# Altium schematic sheet Main MCU.SchDoc
size A; SheetNumber: 1; SheetTotal: 3
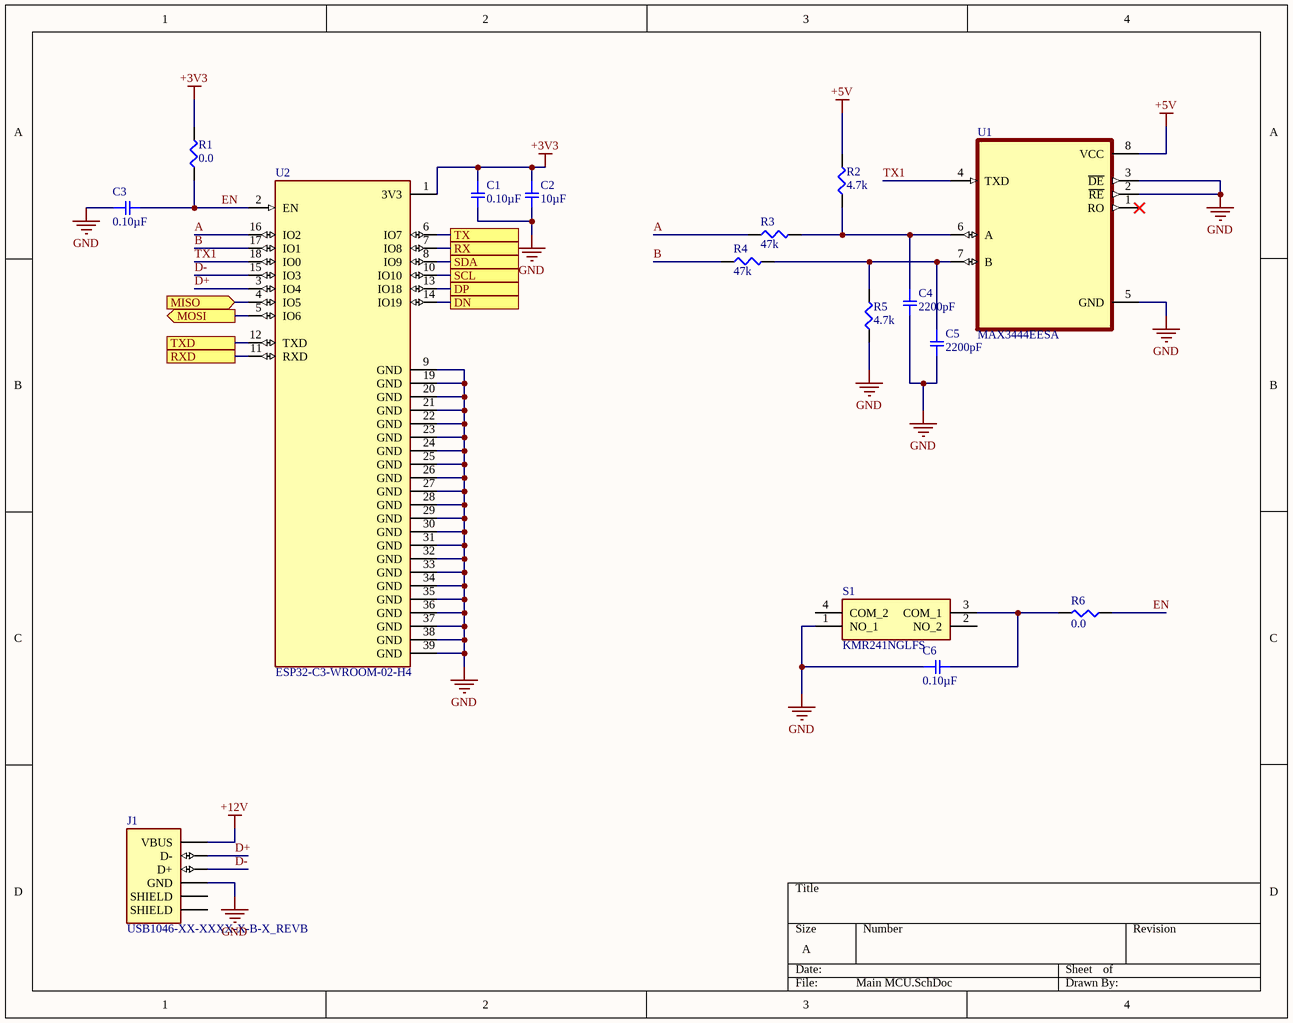
[diagram p0: Main MCU.SchDoc]

## Parts
C1  0.10µF  [SMD-0402C]
C2  10µF  [SMD-0402C]
C3  0.10µF  [SMD-0402C]
C4  2200pF  [SMD-0402C]
C5  2200pF  [SMD-0402C]
C6  0.10µF  [SMD-0402C]
J1  USB1046-XX-XXXX-X-B-X_REVB  [GCT_USB1046-XX-XXXX-X-B-X_REVB]
R1  0.0  [SMD-0402-RES]
R2  4.7k  [SMD-0402-RES]
R3  47k  [SMD-0402-RES]
R4  47k  [SMD-0402-RES]
R5  4.7k  [SMD-0402-RES]
R6  0.0  [SMD-0402-RES]
S1  KMR241NGLFS  [KMR241NGLFS]
U1  MAX3444EESA  [SOIC127P600X175-8N]
U2  ESP32-C3-WROOM-02-H4  [MODULE_ESP32-C3-WROOM-02-H4]

## Ports
DN, DP, MISO (in), MOSI (out), RX, RXD, SCL, SDA, TX, TXD

## Nets
+3V3: C1.1 C2.1 R1.2 U2.1(3V3)
+5V: R2.2 U1.8(VCC)
+12V: J1.1(VBUS)
GND: C1.2 C2.2 C3.1 C4.2 C5.2 C6.1 J1.4(GND) R5.1 S1.1(NO_1) U1.2(~{RE}) U1.3(~{DE}) U1.5(GND) U2.9(GND) U2.19(GND) U2.20(GND) U2.21(GND) U2.22(GND) U2.23(GND) U2.24(GND) U2.25(GND) U2.26(GND) U2.27(GND) U2.28(GND) U2.29(GND) U2.30(GND) U2.31(GND) U2.32(GND) U2.33(GND) U2.34(GND) U2.35(GND) U2.36(GND) U2.37(GND) U2.38(GND) U2.39(GND)
A: R3.1 U2.16(IO2)
B: R4.1 U2.17(IO1)
D+: J1.2(D-) U2.3(IO4)
D-: J1.3(D+) U2.15(IO3)
DN: U2.14(IO19) ; port DN
DP: U2.13(IO18) ; port DP
EN: C3.2 R1.1 R6.1 U2.2(EN)
MISO: U2.4(IO5) ; port MISO
MOSI: U2.5(IO6) ; port MOSI
RX: U2.7(IO8) ; port RX
RXD: U2.11(RXD) ; port RXD
SCL: U2.10(IO10) ; port SCL
SDA: U2.8(IO9) ; port SDA
TX: U2.6(IO7) ; port TX
TX1: U1.4(TXD) U2.18(IO0)
TXD: U2.12(TXD) ; port TXD
NetC4_1: C4.1 R2.1 R3.2 U1.6(A)
NetC5_1: C5.1 R4.2 R5.2 U1.7(B)
NetC6_2: C6.2 R6.2 S1.3(COM_1)

Not connected (* = marked no-connect by the designer): J1 P1(SHIELD) P2(SHIELD); S1 2(NO_2) 4(COM_2); U1 1(RO)*

## Library data of the parts
C1 C3 C6 = GCM155R71C104KA55D: CAP CER 0.1UF 16V X7R 0402; Manufacturer: Murata Electronics North America; Factory Stock: 0; Unit Price (USD): 0.1; Minimum Quantity: 1; Tolerance: ±10%; Datasheets: http://www.murata.com/~/media/webrenewal/support/library/catalog/products/capacitor/mlcc/c03e.ashx; Image: //media.digikey.com/Renders/Murata%20Renders/ZRB-SERIES-0402.jpg; Digi-Key Part Number: 490-4759-1-ND; Part Number: GCM155R71C104KA55D; Quantity Available: 734194; @ qty: 0; Packaging: Cut Tape (CT); Series: GCM; Part Status: Active; Value: 0.10µF; Voltage: 16V; Temperature Coefficient: X7R; Operating Temperature: -55°C ~ 125°C; Features: -; Ratings: AEC-Q200; Applications: Automotive; Mounting Type: Surface Mount, MLCC; Package / Case: 0402 (1005 Metric); Size / Dimension: 0.039" L x 0.020" W (1.00mm x 0.50mm); Height - Seated (Max): -; Thickness (Max): 0.022" (0.55mm); Lead Spacing: -; Lead Style: -
C2 = GRJ155R60J106ME11D: CAP CER 10UF 6.3V X5R 0402; Manufacturer: Murata Electronics North America; Factory Stock: 0; Unit Price (USD): 0.23; Minimum Quantity: 1; Tolerance: ±20%; Datasheets: http://psearch.en.murata.com/capacitor/product/GRJ155R60J106ME11%23.pdf; Image: //media.digikey.com/Renders/Murata%20Renders/ZRB-SERIES-0402.jpg; Digi-Key Part Number: 490-13211-1-ND; Part Number: GRJ155R60J106ME11D; Quantity Available: 64064; @ qty: 0; Packaging: Cut Tape (CT); Series: GRJ; Part Status: Active; Value: 10µF; Voltage: 6.3V; Temperature Coefficient: X5R; Operating Temperature: -55°C ~ 85°C; Features: Derating Recommended, Soft Termination; Ratings: -; Applications: Boardflex Sensitive; Mounting Type: Surface Mount, MLCC; Package / Case: 0402 (1005 Metric); Size / Dimension: 0.039" L x 0.020" W (1.00mm x 0.50mm); Height - Seated (Max): -; Thickness (Max): 0.028" (0.70mm); Lead Spacing: -; Lead Style: -
C4 C5 = GCM155R71H222KA37D: CAP CER 2200PF 50V X7R 0402; Manufacturer: Murata Electronics North America; Factory Stock: 0; Unit Price (USD): 0.1; Minimum Quantity: 1; Tolerance: ±10%; Datasheets: http://www.murata.com/~/media/webrenewal/support/library/catalog/products/capacitor/mlcc/c03e.ashx; Image: //media.digikey.com/Renders/Murata%20Renders/ZRB-SERIES-0402.jpg; Digi-Key Part Number: 490-4914-1-ND; Part Number: GCM155R71H222KA37D; Quantity Available: 56459; @ qty: 0; Packaging: Cut Tape (CT); Series: GCM; Part Status: Active; Value: 2200pF; Voltage: 50V; Temperature Coefficient: X7R; Operating Temperature: -55°C ~ 125°C; Features: -; Ratings: AEC-Q200; Applications: Automotive; Mounting Type: Surface Mount, MLCC; Package / Case: 0402 (1005 Metric); Size / Dimension: 0.039" L x 0.020" W (1.00mm x 0.50mm); Height - Seated (Max): -; Thickness (Max): 0.022" (0.55mm); Lead Spacing: -; Lead Style: -
J1 = USB1046-XX-XXXX-X-B-X_REVB: USB Receptacle, Type A, 4 Pin, Surface Mount, Horizontal, Top Mount, with Shell Stakes; MF: {'manufacturer': u'Global Connector Technology'}; Package: None; Price: None; Value: *; MP: USB1046-XX-XXXX-X-B-X_REVB; Availability: Unavailable
R1 R6 = ERJ-2GE0R00X: RES SMD 0.0OHM JUMPER 1/10W 0402; Manufacturer: Panasonic Electronic Components; Factory Stock: 0; Unit Price (USD): 0.00384; @ qty: 1500; Minimum Quantity: 1; Power (Watts): 0.1W, 1/10W; Part Number: ERJ-2GE0R00X; Datasheets: http://industrial.panasonic.com/www-cgi/jvcr13pz.cgi?E+PZ+3+AOA0001+ERJ2GE0R00X+7+WW; Image: //media.digikey.com/Photos/Panasonic%20Photos/ERJ-PA2-Series.jpg; Digi-Key Part Number: P0.0JCT-ND; Quantity Available: 3152483; Packaging: Cut Tape (CT); Series: ERJ; Part Status: Active; Value: 0.0; Tolerance: Jumper; Composition: Thick Film; Features: Automotive AEC-Q200; Temperature Coefficient: -; Operating Temperature: -55°C ~ 155°C; Package / Case: 0402 (1005 Metric); Supplier Device Package: 0402; Size / Dimension: 0.039" L x 0.020" W (1.00mm x 0.50mm); Height - Seated (Max): 0.016" (0.40mm); Number of Terminations: 2; Failure Rate: -
R2 R5 = ERJ-2GEJ472X: RES SMD 4.7K OHM 5% 1/10W 0402; Manufacturer: Panasonic Electronic Components; Factory Stock: 0; Unit Price (USD): 0.00350; @ qty: 1500; Minimum Quantity: 1; Power (Watts): 0.1W, 1/10W; Temperature Coefficient: ±200ppm/°C; Part Number: ERJ-2GEJ472X; Datasheets: http://industrial.panasonic.com/www-cgi/jvcr13pz.cgi?E+PZ+3+AOA0001+ERJ2GEJ472X+7+WW; Image: //media.digikey.com/Photos/Panasonic%20Photos/ERJ-PA2-Series.jpg; Digi-Key Part Number: P4.7KJCT-ND; Quantity Available: 8551774; Packaging: Cut Tape (CT); Series: ERJ; Part Status: Active; Value: 4.7k; Tolerance: ±5%; Composition: Thick Film; Features: Automotive AEC-Q200; Operating Temperature: -55°C ~ 155°C; Package / Case: 0402 (1005 Metric); Supplier Device Package: 0402; Size / Dimension: 0.039" L x 0.020" W (1.00mm x 0.50mm); Height - Seated (Max): 0.016" (0.40mm); Number of Terminations: 2; Failure Rate: -
R3 R4 = ERJ-2GEJ473X: RES SMD 47K OHM 5% 1/10W 0402; Manufacturer: Panasonic Electronic Components; Factory Stock: 0; Unit Price (USD): 0.00350; @ qty: 1500; Minimum Quantity: 1; Power (Watts): 0.1W, 1/10W; Temperature Coefficient: ±200ppm/°C; Part Number: ERJ-2GEJ473X; Datasheets: http://industrial.panasonic.com/www-cgi/jvcr13pz.cgi?E+PZ+3+AOA0001+ERJ2GEJ473X+7+WW; Image: //media.digikey.com/Photos/Panasonic%20Photos/ERJ-PA2-Series.jpg; Digi-Key Part Number: P47KJCT-ND; Quantity Available: 5182645; Packaging: Cut Tape (CT); Series: ERJ; Part Status: Active; Value: 47k; Tolerance: ±5%; Composition: Thick Film; Features: Automotive AEC-Q200; Operating Temperature: -55°C ~ 155°C; Package / Case: 0402 (1005 Metric); Supplier Device Package: 0402; Size / Dimension: 0.039" L x 0.020" W (1.00mm x 0.50mm); Height - Seated (Max): 0.016" (0.40mm); Number of Terminations: 2; Failure Rate: -
S1 = KMR241NGLFS: Switch; Manufacturer_Name: C & K COMPONENTS; Datasheet Link: https://www.ckswitches.com/media/1479/kmr2.pdf; Height: 1.9mm; Manufacturer_Part_Number: KMR241NGLFS; Mouser Part Number: 611-KMR241NGLFS; Mouser Price/Stock: https://www.mouser.co.uk/ProductDetail/CK/KMR241NGLFS?qs=sb%252But3Lm4x3MOq2auuFbeg%3D%3D; Arrow Part Number: KMR241NGLFS; Arrow Price/Stock: https://www.arrow.com/en/products/kmr241nglfs/ck
U1 = MAX3444EESA: MF: {'manufacturer': u'Analog Devices'}; Package: None; Price: None; Value: *; MP: MAX3444EESA; Availability: Unavailable
U2 = ESP32-C3-WROOM-02-H4: WiFi Modules (802.11) (Engineering Samples) SMD module, ESP32-C3, 4MB SPI flash, PCB antenna, -40 C +105 C   <a href="https://pricing.snapeda.com/parts/ESP32-C3-WROOM-02-H4/Espressif%20Systems/view-part?ref=eda">Check availability</a> <a href="https://pricing.snapeda.com/parts/ESP32-C3-WROOM-02-H4/Espressif%20Systems/view-part?ref=eda">Check availability</a>; MF: {'manufacturer': u'Espressif Systems'}; Package: None; Price: None; Value: *; MP: ESP32-C3-WROOM-02-H4; Availability: Unavailable